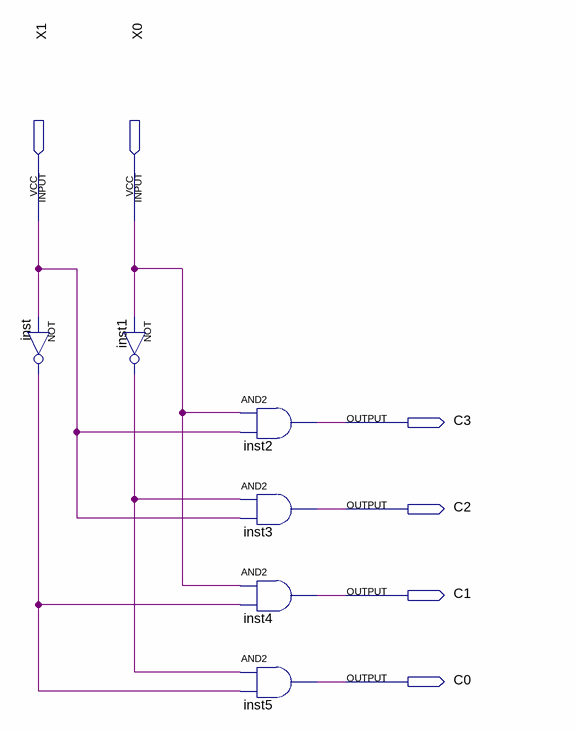
[diagram p0: schematic sheet]
// Quartus schematic Lab2_banhang.bdf as structural Verilog: 6 symbols, 6 pins
module Lab2_banhang (
  input  X1,
  input  X0,
  output C3,
  output C2,
  output C1,
  output C0
);

  wire inst1_out, inst_out;

  not inst (inst_out, X1);
  not inst1 (inst1_out, X0);
  and inst2 (C3, X0, X1);
  and inst3 (C2, inst1_out, X1);
  and inst4 (C1, X0, inst_out);
  and inst5 (C0, inst1_out, inst_out);
endmodule
